# EAGLE design kegboard-coaster-alt (EAGLE 5.11)
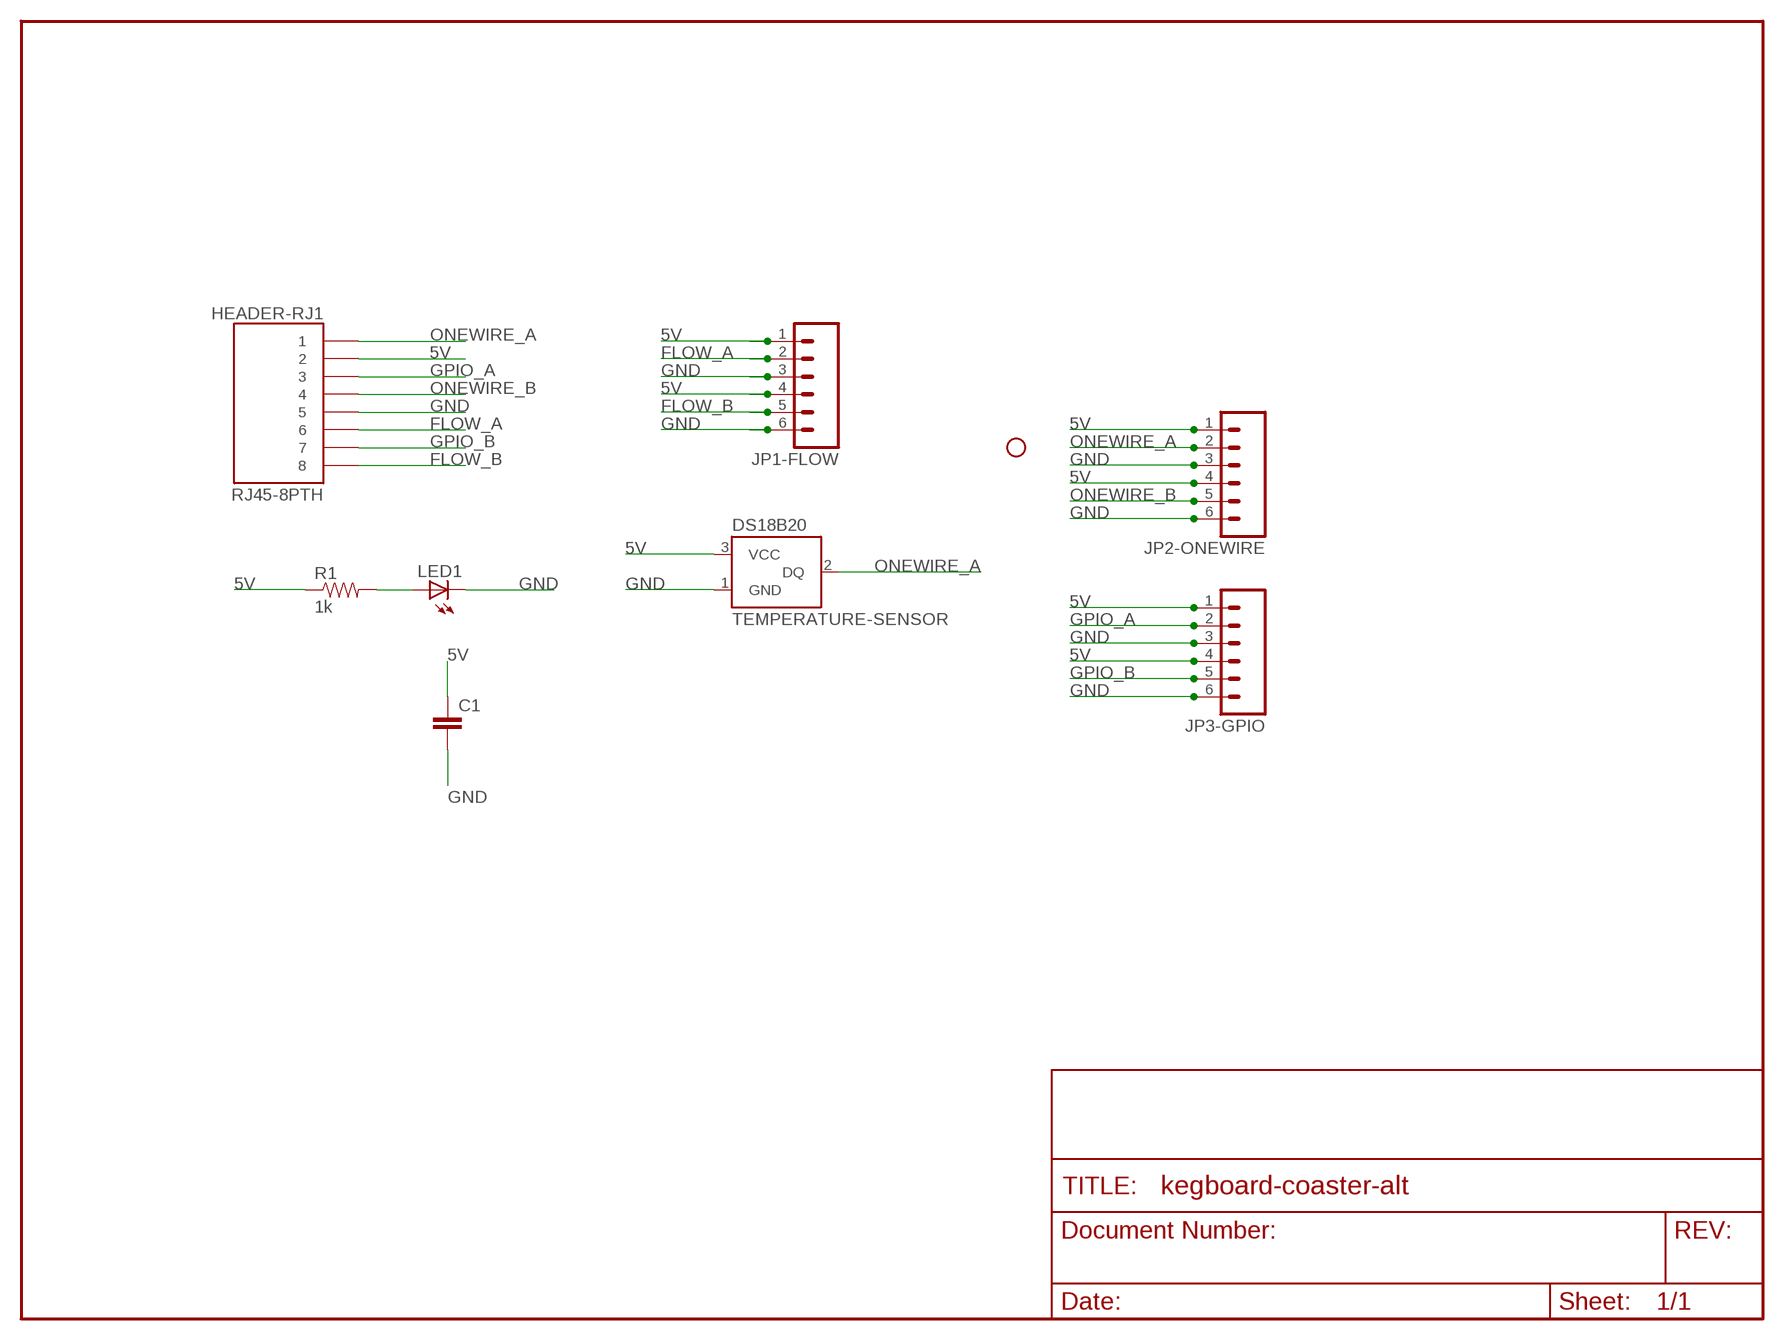
[diagram p0: schematic, sheet 1]

## Parts
C1  CAPPTH2  [CAP-PTH-SMALL2]
HEADER-RJ1  RJ45-8PTH  [RJ45-8]
JP1-FLOW  M063.5MM-6  [SCREWTERMINAL-3.5MM-6]
JP2  STAND-OFF  [STAND-OFF]
JP2-ONEWIRE  M063.5MM-6  [SCREWTERMINAL-3.5MM-6]
JP3-GPIO  M063.5MM-6  [SCREWTERMINAL-3.5MM-6]
LED1  LED3MM  [LED3MM]
R1  1k  RESISTORPTH1  [AXIAL-0.3]
U$1  TEMPERATURE-SENSOR  [TO-92]

## Nets
5V: C1.1 HEADER-RJ1.2 JP1-FLOW.1 JP1-FLOW.4 JP2-ONEWIRE.1 JP2-ONEWIRE.4 JP3-GPIO.1 JP3-GPIO.4 R1.P$1 U$1.3(VCC)
FLOW_A: HEADER-RJ1.6 JP1-FLOW.2
FLOW_B: HEADER-RJ1.8 JP1-FLOW.5
GND: C1.2 HEADER-RJ1.5 JP1-FLOW.3 JP1-FLOW.6 JP2-ONEWIRE.3 JP2-ONEWIRE.6 JP3-GPIO.3 JP3-GPIO.6 LED1.K(C) U$1.1(GND)
GPIO_A: HEADER-RJ1.3 JP3-GPIO.2
GPIO_B: HEADER-RJ1.7 JP3-GPIO.5
N$1: LED1.A R1.P$2
ONEWIRE_A: HEADER-RJ1.1 JP2-ONEWIRE.2 U$1.2(DQ)
ONEWIRE_B: HEADER-RJ1.4 JP2-ONEWIRE.5

## Library data of the parts
C1 = SparkFun-20100412:CAP: Capacitor Standard 0603 ceramic capacitor, and 0.1" leaded capacitor.
HEADER-RJ1 = SparkFun:RJ45-8: RJ45 Jack Simple RJ45, 8-pin connection - connector for common Cat5, Cat5e, and Cat6 Ethernet cables. Footprint not yet proven in production. Connector sku is PRT-00643; Breakout PCB sku is BOB-00716.
JP1-FLOW JP2-ONEWIRE JP3-GPIO = SparkFun:M06: Header 6 Standard 6-pin 0.1" header. Use with straight break away headers (SKU : PRT-00116), right angle break away headers (PRT-00553), swiss pins (PRT-00743), machine pins (PRT-00117), and female headers (PRT-00115). Molex polarized connector foot print use with SKU : PRT-08094 with associated crimp pins and housings. NOTES ON THE VARIANTS LOCK and LOCK_LONGPADS... This footprint was designed to help hold the alignment of a through-hole component (i.e. 6-pin header) while soldering it into place. You may notice that each hole has been shifted either up or down by 0.005 of an inch from it's more standard position (which is a perfectly straight line). This slight alteration caused the pins (the squares in the middle) to touch the edges of the holes. Because they are alternating, it causes a "brace" to hold the component in place. 0.005 has proven to be the perfect amount of "off-center" position when using our standard breakaway headers. Although looks a little odd when you look at the bare footprint, once you have a header in there, the alteration is very hard to notice. Also, if you push a header all the way into place, it is covered up entirely on the bottom side. This idea of altering the position of holes to aid alignment will be further integrated into the Sparkfun Library for other footprints. It can help hold any component with 3 or more connection pins.
JP2 = SparkFun-20100412:STAND-OFF: Stand Off This is the mechanical footprint for a #4 phillips button head screw. Use the keepout ring to avoid running the screw head into surrounding components. SKU : PRT-00447
LED1 = SparkFun:LED: LEDs Standard schematic elements and footprints for 5mm, 3mm, 1206, and 0603 sized LEDs. 5mm - Spark Fun Electronics SKU : COM-00529 (and others)
R1 = SparkFun:RESISTOR: Resistor Basic schematic elements and footprints for 0603, 1206, and PTH 1/10th watt (small) resistors.
U$1 = geoffculp:TEMPERATURE-SENSOR

## Board
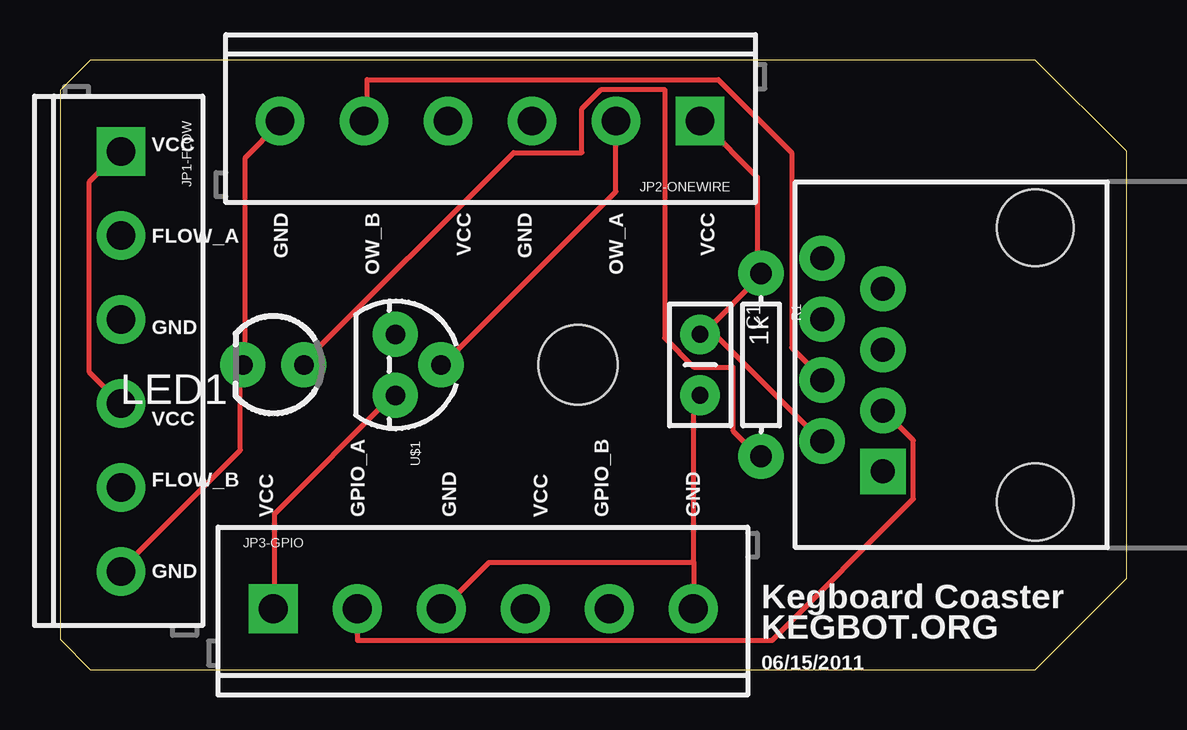
[diagram p1: board, top side]
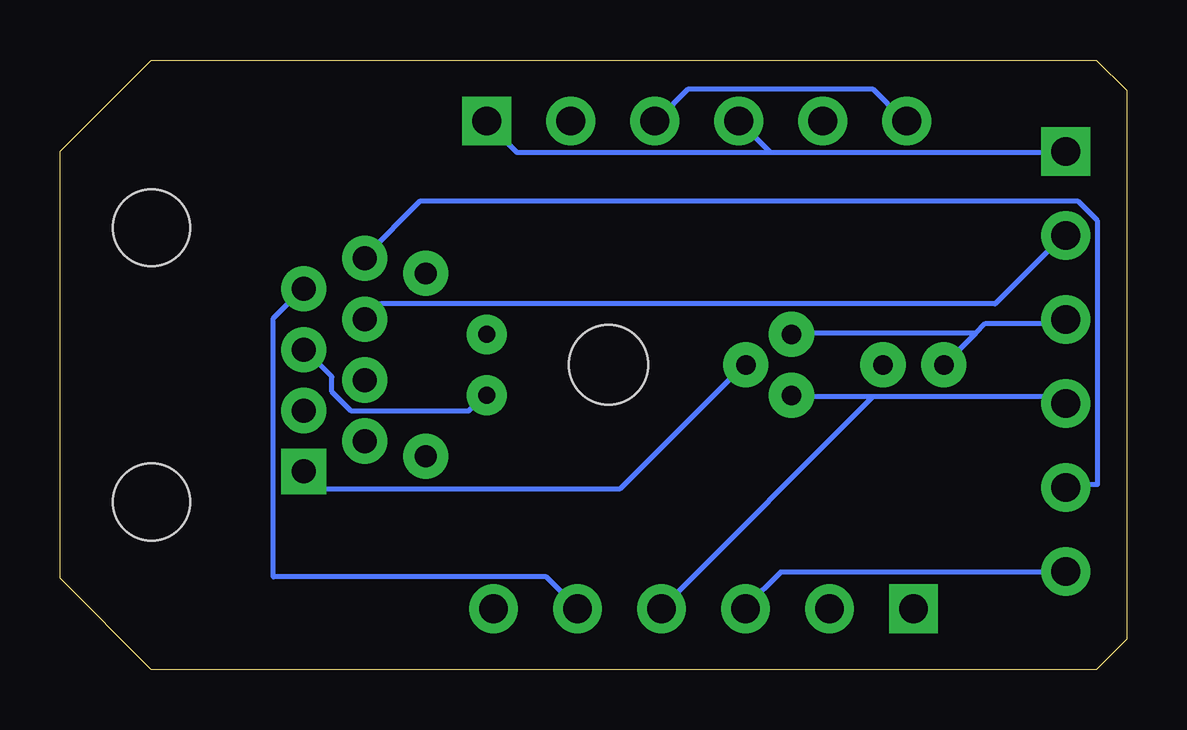
[diagram p2: board, bottom side, seen from below]

Size 44.45 x 25.4 mm. Coordinates in mm from the lower left corner, seen from the top.
Outline: 0,1.27 1.27,0 40.64,0 44.45,3.81 44.45,21.59 40.64,25.4 1.27,25.4 0,24.13 0,1.27
Copper layers (1*16): Top 0.035mm / dielectric 1.5mm / Bottom 0.035mm
Design rules "SparkFun": minimum track width 8mil, minimum drill 20mil, track to track 8mil, track to pad 8mil, pad to pad 8mil, via to via 8mil, smd to smd 8mil, copper to edge 10mil, drill to drill 8mil, minimum pad ring 12mil, minimum via ring 10mil, stop-mask expansion 4mil, vias tented up to drill 25mil, thermal gap 10mil

### Footprints (pad centres in the part's own frame; a part is rotated, then mirrored left to right if it is on the bottom)
CAP-PTH-SMALL2 = drill 0.7 pad 1.651 round: 1 0,0; 2 2.54,0
RJ45-8 = drill 1 pad 1.88 square: 1 -4.445,6.35 | drill 1 pad 1.88 round: 2 -3.175,8.89; 3 -1.905,6.35; 4 -0.635,8.89; 5 0.635,6.35; 6 1.905,8.89; 7 3.175,6.35; 8 4.445,8.89 | hole 3.2: -5.715,0; 5.715,0
SCREWTERMINAL-3.5MM-6 = drill 1.2 pad 2.032 square: 1 0,0 | drill 1.2 pad 2.032 round: 2 3.5,0; 3 7,0; 4 10.5,0; 5 14,0; 6 17.5,0
STAND-OFF = hole 3.302: 0,0
LED3MM = drill 0.813 pad 1.88 round: A -1.27,0; K 1.27,0
AXIAL-0.3 = drill 0.9 pad 1.88 round: P$1 -3.81,0; P$2 3.81,0
TO-92 = drill 0.813 pad 1.88 round: 1 -1.27,0; 2 0,1.905; 3 1.27,0

### Placement (x,y rotation side)
C1  26.67,13.97 270 top
HEADER-RJ1  40.64,12.7 90 top
JP1-FLOW  2.54,21.59 270 top
JP2  21.59,12.7 0 top
JP2-ONEWIRE  26.67,22.86 180 top
JP3-GPIO  8.89,2.54 0 top
LED1  8.89,12.7 180 top
R1  29.21,12.7 270 top
U$1  13.97,12.7 270 top

### Tracks (layer width: path | path; a pad name or v marks a point on that pad's centre or on a via)
5V
  Top 0.203: 27.03,14.22 29.06,16.26 29.06,16.46 R1.P$1 29.06,16.66 29.06,20.52 26.82,22.76 JP2-ONEWIRE.1 | 27.03,14.22 26.82,14.02 C1.1 27.03,14.22 | 27.03,14.22 31.7,9.55 HEADER-RJ1.2 | U$1.3 13.82,11.38 8.94,6.5 8.94,2.64 JP3-GPIO.1 | JP1-FLOW.1 2.44,21.54 1.22,20.32 1.22,12.39 2.44,11.18 JP1-FLOW.4
  Bottom 0.203: 10.57,11.38 13.82,11.38 U$1.3 | 10.57,11.38 2.85,11.38 2.64,11.18 JP1-FLOW.4 | 10.57,11.38 19.3,2.64 JP3-GPIO.4 | 14.83,21.54 16.05,22.76 JP2-ONEWIRE.4 | 14.83,21.54 2.64,21.54 JP1-FLOW.1 | 14.83,21.54 25.4,21.54 26.62,22.76 JP2-ONEWIRE.1
FLOW_A
  Bottom 0.203: HEADER-RJ1.6 31.7,14.63 31.09,15.24 5.49,15.24 2.64,18.09 JP1-FLOW.2
FLOW_B
  Bottom 0.203: HEADER-RJ1.8 31.7,17.27 29.46,19.51 2.03,19.51 1.22,18.69 1.22,7.72 2.44,7.72 JP1-FLOW.5
GND
  Top 0.203: 26.42,4.47 26.42,2.64 JP3-GPIO.6 | 26.42,4.47 26.42,11.18 C1.2 | 26.42,4.47 17.88,4.47 16.05,2.64 JP3-GPIO.3 | JP1-FLOW.6 2.64,4.27 7.52,9.14 7.52,12.6 LED1.K 7.72,12.8 7.72,21.34 9.14,22.76 JP2-ONEWIRE.6
  Bottom 0.203: HEADER-RJ1.5 34.14,13.21 33.12,12.19 33.12,11.58 32.31,10.77 27.43,10.77 26.82,11.38 C1.2 | 6.3,14.02 5.89,14.43 2.64,14.43 JP1-FLOW.3 | LED1.K 6.3,14.02 | 6.3,14.02 13.82,14.02 U$1.1 | JP2-ONEWIRE.3 19.51,22.96 18.29,24.18 10.57,24.18 9.35,22.96 JP2-ONEWIRE.6 | JP3-GPIO.3 15.85,2.64 14.43,4.06 2.64,4.06 JP1-FLOW.6
GPIO_A
  Top 0.203: HEADER-RJ1.3 34.34,10.77 35.56,9.55 35.56,7.11 29.67,1.22 12.39,1.22 12.39,2.44 JP3-GPIO.2
GPIO_B
  Bottom 0.203: HEADER-RJ1.7 34.34,15.85 35.56,14.63 35.56,3.86 24.18,3.86 22.96,2.64 JP3-GPIO.5
N$1
  Top 0.203: LED1.A 10.16,12.8 18.9,21.54 21.74,21.54 21.74,23.37 22.55,24.18 25.2,24.18 25.2,13.82 26.42,12.6 28.04,12.6 28.04,9.96 29.06,8.94 R1.P$2
ONEWIRE_A
  Top 0.203: U$1.2 16.05,12.8 23.16,19.91 23.16,22.76 JP2-ONEWIRE.2
  Bottom 0.203: HEADER-RJ1.1 34.14,8.13 33.53,7.52 21.13,7.52 16.05,12.6 U$1.2
ONEWIRE_B
  Top 0.203: HEADER-RJ1.4 31.7,12.19 30.48,13.41 30.48,21.54 27.43,24.59 12.8,24.59 12.8,22.96 JP2-ONEWIRE.5

### Text on the board
tPlace: VCC | GND | OW_B | VCC | GND | OW_A | VCC | FLOW_A | GND | VCC | FLOW_B | VCC | GPIO_A | GND | VCC | GPIO_B | GND | GND | Kegboard Coaster | KEGBOT.ORG | 06/15/2011